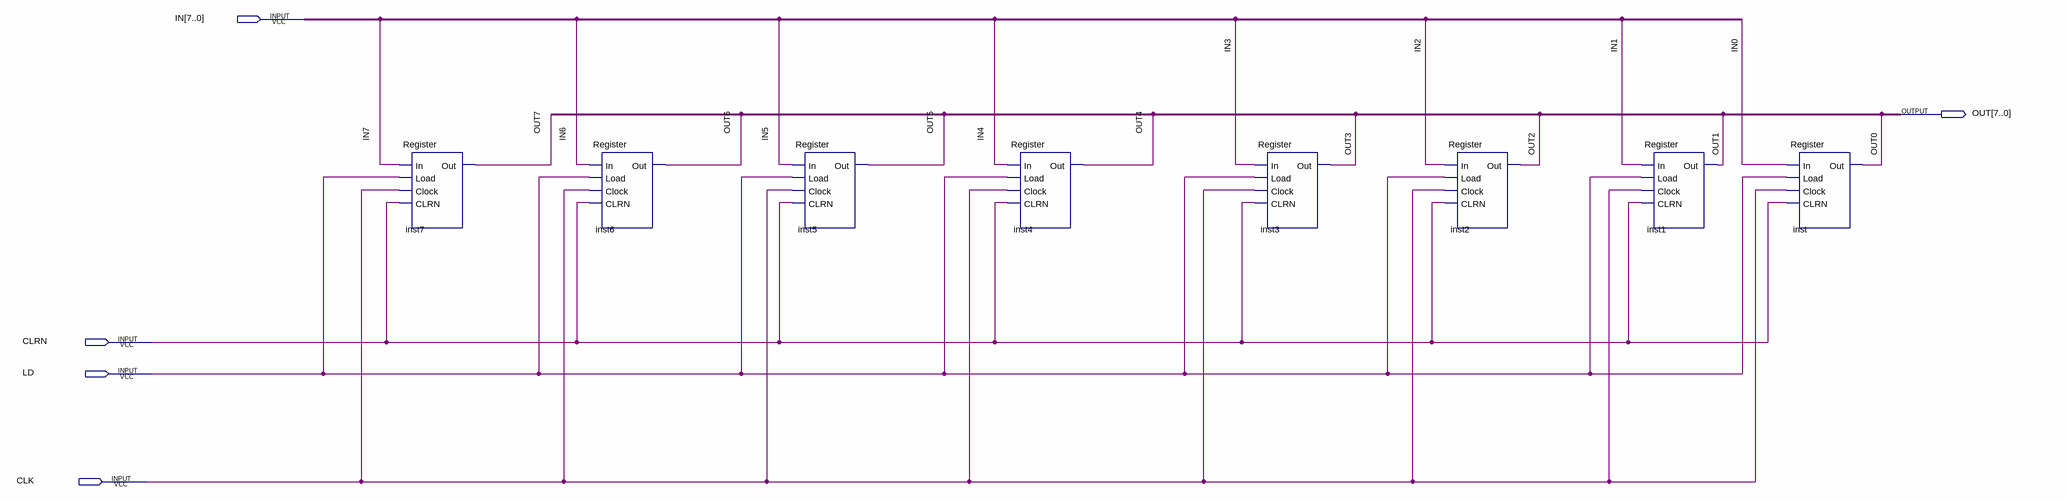
[diagram p0: schematic sheet]
// Quartus schematic reg8b.bdf as structural Verilog: 8 symbols, 5 pins
module reg8b (
  input  [7:0] IN,
  input  CLRN,
  input  LD,
  input  CLK,
  output [7:0] OUT
);

  Register inst7 (.In(IN[7]), .Load(LD), .Clock(CLK), .CLRN(CLRN), .Out(OUT[7]));
  Register inst6 (.In(IN[6]), .Load(LD), .Clock(CLK), .CLRN(CLRN), .Out(OUT[6]));
  Register inst5 (.In(IN[5]), .Load(LD), .Clock(CLK), .CLRN(CLRN), .Out(OUT[5]));
  Register inst4 (.In(IN[4]), .Load(LD), .Clock(CLK), .CLRN(CLRN), .Out(OUT[4]));
  Register inst3 (.In(IN[3]), .Load(LD), .Clock(CLK), .CLRN(CLRN), .Out(OUT[3]));
  Register inst2 (.In(IN[2]), .Load(LD), .Clock(CLK), .CLRN(CLRN), .Out(OUT[2]));
  Register inst1 (.In(IN[1]), .Load(LD), .Clock(CLK), .CLRN(CLRN), .Out(OUT[1]));
  Register inst (.In(IN[0]), .Load(LD), .Clock(CLK), .CLRN(CLRN), .Out(OUT[0]));
endmodule
